# Altium project rp42.PrjPcb
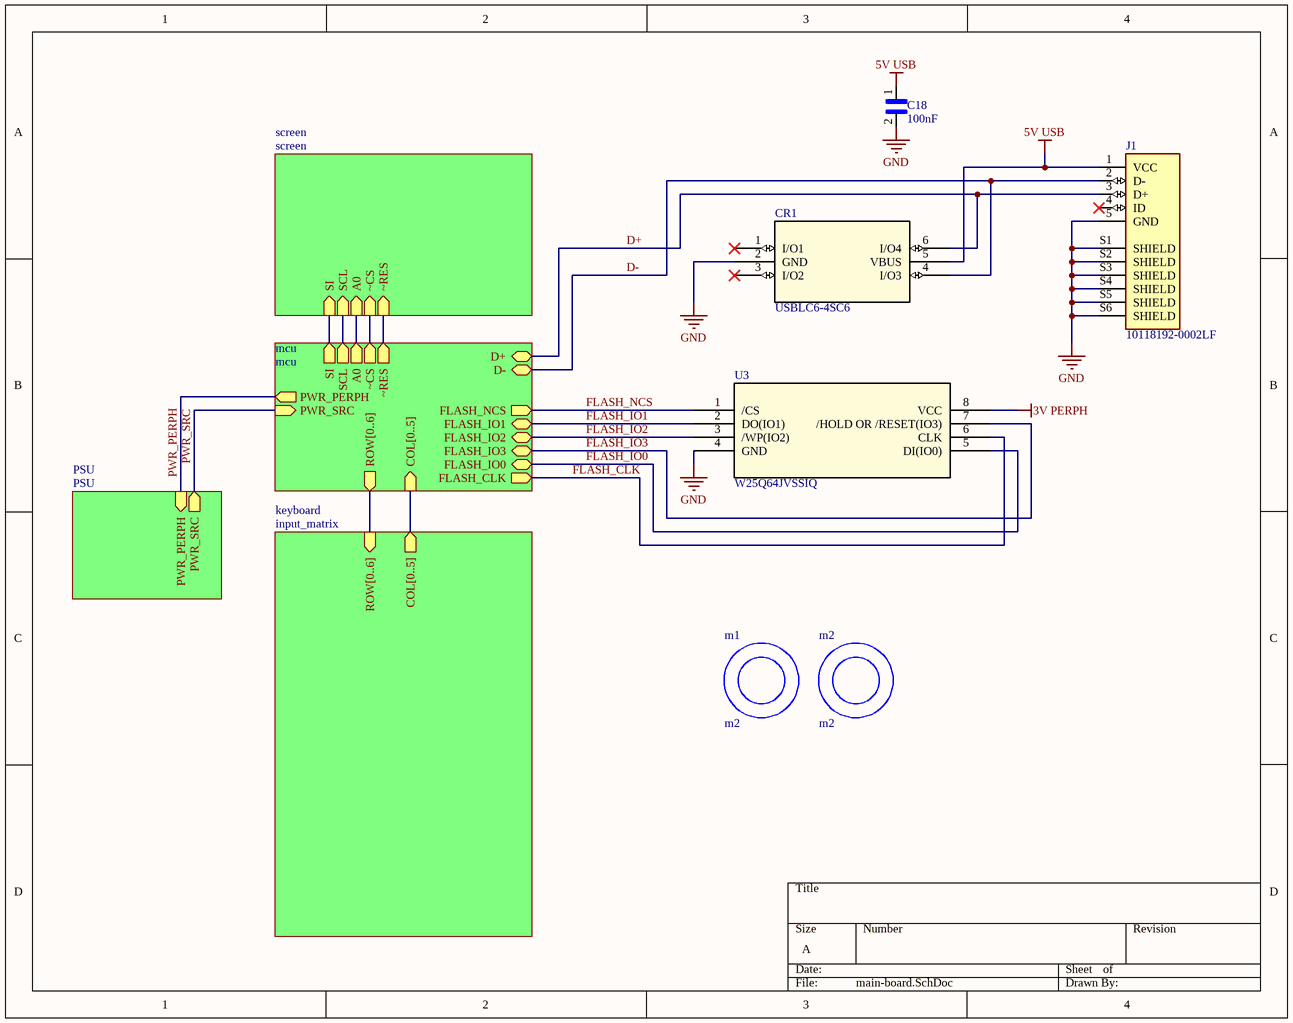
[diagram p0: main-board.SchDoc]
5 sheets, 74 parts. Net scope: hierarchical (ports join the sheet entries above them; power ports are global).
Board file: main-board.PcbDoc
Sheets:
  main-board.SchDoc
    keyboard = input_matrix.SchDoc
    mcu = mcu.SchDoc
    screen = screen.SchDoc
    PSU = PSU.SchDoc

## Sheet main-board.SchDoc
size A; SheetNumber: 1; SheetTotal: 5

### Parts
C18  100nF  [CAPC1005X55N]
CR1  USBLC6-4SC6  [SOT23-6L_STM]
J1  10118192-0002LF  [AMPHENOL_10118192-0002LF]
m1  m2  [m2]
m2  m2  [m2]
U3  W25Q64JVSSIQ  [SOIC-8_5P28X5P28_WIN]

### Sub-sheets
keyboard = input_matrix: ROW[0..6] (in), COL[0..5] (out)
mcu = mcu: ROW[0..6] (out), COL[0..5] (in), SI (out), SCL (out), A0 (out), ~CS (out), ~RES (out), FLASH_IO1 (bidir), FLASH_IO0 (bidir), FLASH_CLK (out), FLASH_NCS (out), FLASH_IO2 (bidir), FLASH_IO3 (bidir), PWR_SRC (in), D- (bidir), D+ (bidir), PWR_PERPH (out)
PSU = PSU: PWR_SRC (out), PWR_PERPH (in)
screen = screen: SI (in), SCL (in), A0 (in), ~CS (in), ~RES (in)

### Nets
3V PERPH: U3.8(VCC)
5V USB: C18.1 CR1.5(VBUS) J1.1(VCC)
GND: C18.2 CR1.2(GND) J1.5(GND) J1.S1(SHIELD) J1.S2(SHIELD) J1.S3(SHIELD) J1.S4(SHIELD) J1.S5(SHIELD) J1.S6(SHIELD) U3.4(GND)
D+: CR1.6(I/O4) J1.3(D+) ; sheet mcu/D+
D-: CR1.4(I/O3) J1.2(D-) ; sheet mcu/D-
FLASH_CLK: U3.6(CLK) ; sheet mcu/FLASH_CLK
FLASH_IO0: U3.5(DI(IO0)) ; sheet mcu/FLASH_IO0
FLASH_IO1: U3.2(DO(IO1)) ; sheet mcu/FLASH_IO1
FLASH_IO2: U3.3(/WP(IO2)) ; sheet mcu/FLASH_IO2
FLASH_IO3: U3.7(/HOLD_OR_/RESET(IO3)) ; sheet mcu/FLASH_IO3
FLASH_NCS: U3.1(/CS) ; sheet mcu/FLASH_NCS
LCD_A0: sheet mcu/A0, sheet screen/A0
LCD_CS: sheet mcu/~CS, sheet screen/~CS
LCD_RES: sheet mcu/~RES, sheet screen/~RES
LCD_SCL: sheet mcu/SCL, sheet screen/SCL
LCD_SI: sheet mcu/SI, sheet screen/SI
PWR_PERPH: sheet mcu/PWR_PERPH, sheet PSU/PWR_PERPH
PWR_SRC: sheet mcu/PWR_SRC, sheet PSU/PWR_SRC

Not connected (* = marked no-connect by the designer): CR1 1(I/O1)* 3(I/O2)*; J1 4(ID)*

### Buses and harness runs
bus sheet keyboard/COL[0..5] = sheet mcu/COL[0..5]
bus sheet keyboard/ROW[0..6] = sheet mcu/ROW[0..6]

### Library data of the parts
C18 = CL05B104KP5NNNC: 0.1ÂµF Â±10% 10V Ceramic Capacitor X7R 0402 _1005 Metric_; MF: Samsung Electro-Mechanics; MP: CL05B104KP5NNNC; Availability: Unavailable; SnapEDA_Link: https://www.snapeda.com/parts/CL05B104KP5NNNC/Samsung%20Electro-Mechanics/view-part/1365387/?ref=snap; Package: 0402 Samsung; Price: None; Value: *
CR1 = USBLC6-4SC6: No Description Available; Mfr_Name: STMicroelectronics; RefDes: RefDes; Type: Type
J1 = 10118192-0002LF: Micro USB 2.0, Input Output Connectors, B TYPE RECEPTACLE without flange; MF: Amphenol ICC; SnapEDA_Link: https://www.snapeda.com/parts/10118192-0002LF/Amphenol+FCI/view-part/?ref=snap; Package: None; Value: *; MP: 10118192-0002LF; Check_prices: https://www.snapeda.com/parts/10118192-0002LF/Amphenol+FCI/view-part/?ref=eda
U3 = W25Q64JVSSIQ: W25Q64JVSSIQ. 64MBit Quad-SPI flash; Mfr_Name: Winbond; RefDes: RefDes; Type: Type

## Sheet input_matrix.SchDoc
size A; SheetNumber: 2; SheetTotal: 5
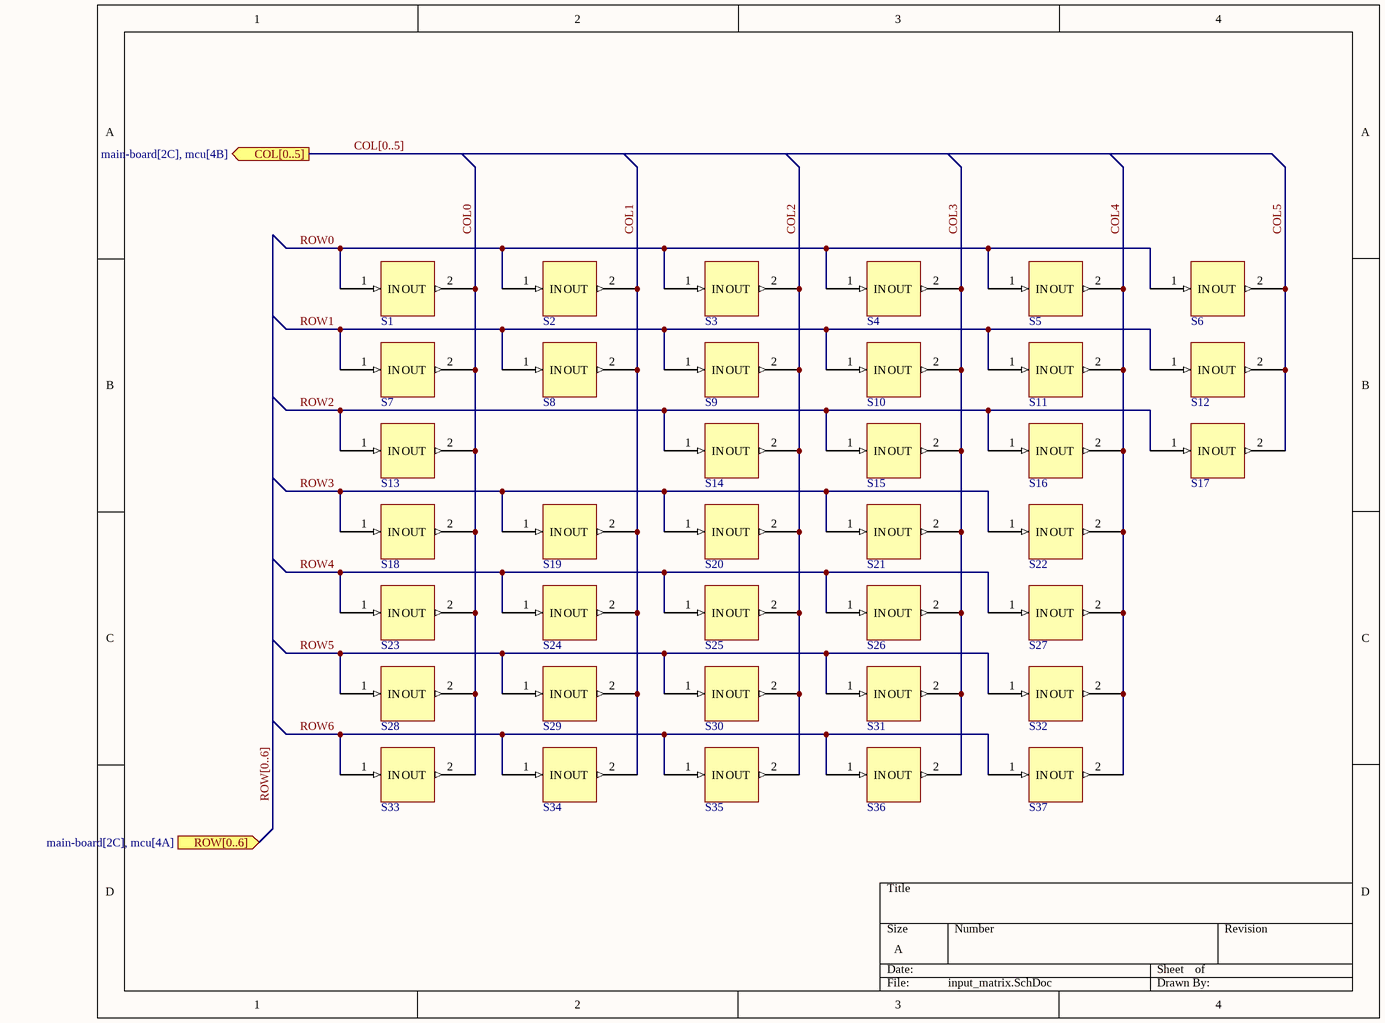
[diagram p1: input_matrix.SchDoc]

### Parts
S1  temp_switch  [PCBComponent_1]  (value not drawn)
S2  temp_switch  [PCBComponent_1]  (value not drawn)
S3  temp_switch  [PCBComponent_1]  (value not drawn)
S4  temp_switch  [PCBComponent_1]  (value not drawn)
S5  temp_switch  [PCBComponent_1]  (value not drawn)
S6  temp_switch  [PCBComponent_1]  (value not drawn)
S7  temp_switch  [PCBComponent_1]  (value not drawn)
S8  temp_switch  [PCBComponent_1]  (value not drawn)
S9  temp_switch  [PCBComponent_1]  (value not drawn)
S10  temp_switch  [PCBComponent_1]  (value not drawn)
S11  temp_switch  [PCBComponent_1]  (value not drawn)
S12  temp_switch  [PCBComponent_1]  (value not drawn)
S13  temp_switch  [PCBComponent_1]  (value not drawn)
S14  temp_switch  [PCBComponent_1]  (value not drawn)
S15  temp_switch  [PCBComponent_1]  (value not drawn)
S16  temp_switch  [PCBComponent_1]  (value not drawn)
S17  temp_switch  [PCBComponent_1]  (value not drawn)
S18  temp_switch  [PCBComponent_1]  (value not drawn)
S19  temp_switch  [PCBComponent_1]  (value not drawn)
S20  temp_switch  [PCBComponent_1]  (value not drawn)
S21  temp_switch  [PCBComponent_1]  (value not drawn)
S22  temp_switch  [PCBComponent_1]  (value not drawn)
S23  temp_switch  [PCBComponent_1]  (value not drawn)
S24  temp_switch  [PCBComponent_1]  (value not drawn)
S25  temp_switch  [PCBComponent_1]  (value not drawn)
S26  temp_switch  [PCBComponent_1]  (value not drawn)
S27  temp_switch  [PCBComponent_1]  (value not drawn)
S28  temp_switch  [PCBComponent_1]  (value not drawn)
S29  temp_switch  [PCBComponent_1]  (value not drawn)
S30  temp_switch  [PCBComponent_1]  (value not drawn)
S31  temp_switch  [PCBComponent_1]  (value not drawn)
S32  temp_switch  [PCBComponent_1]  (value not drawn)
S33  temp_switch  [PCBComponent_1]  (value not drawn)
S34  temp_switch  [PCBComponent_1]  (value not drawn)
S35  temp_switch  [PCBComponent_1]  (value not drawn)
S36  temp_switch  [PCBComponent_1]  (value not drawn)
S37  temp_switch  [PCBComponent_1]  (value not drawn)

### Ports
COL[0..5] (out, see main-board[2C], mcu[4B]), ROW[0..6] (in, see main-board[2C], mcu[4A])

### Nets
COL0: S1.2(OUT) S7.2(OUT) S13.2(OUT) S18.2(OUT) S23.2(OUT) S28.2(OUT) S33.2(OUT)
COL1: S2.2(OUT) S8.2(OUT) S19.2(OUT) S24.2(OUT) S29.2(OUT) S34.2(OUT)
COL2: S3.2(OUT) S9.2(OUT) S14.2(OUT) S20.2(OUT) S25.2(OUT) S30.2(OUT) S35.2(OUT)
COL3: S4.2(OUT) S10.2(OUT) S15.2(OUT) S21.2(OUT) S26.2(OUT) S31.2(OUT) S36.2(OUT)
COL4: S5.2(OUT) S11.2(OUT) S16.2(OUT) S22.2(OUT) S27.2(OUT) S32.2(OUT) S37.2(OUT)
COL5: S6.2(OUT) S12.2(OUT) S17.2(OUT)
ROW0: S1.1(IN) S2.1(IN) S3.1(IN) S4.1(IN) S5.1(IN) S6.1(IN)
ROW1: S7.1(IN) S8.1(IN) S9.1(IN) S10.1(IN) S11.1(IN) S12.1(IN)
ROW2: S13.1(IN) S14.1(IN) S15.1(IN) S16.1(IN) S17.1(IN)
ROW3: S18.1(IN) S19.1(IN) S20.1(IN) S21.1(IN) S22.1(IN)
ROW4: S23.1(IN) S24.1(IN) S25.1(IN) S26.1(IN) S27.1(IN)
ROW5: S28.1(IN) S29.1(IN) S30.1(IN) S31.1(IN) S32.1(IN)
ROW6: S33.1(IN) S34.1(IN) S35.1(IN) S36.1(IN) S37.1(IN)

### Buses and harness runs
bus COL[0..5] = port COL[0..5]
bus ROW[0..6] = port ROW[0..6]

## Sheet mcu.SchDoc
size A; SheetNumber: 4; SheetTotal: 5
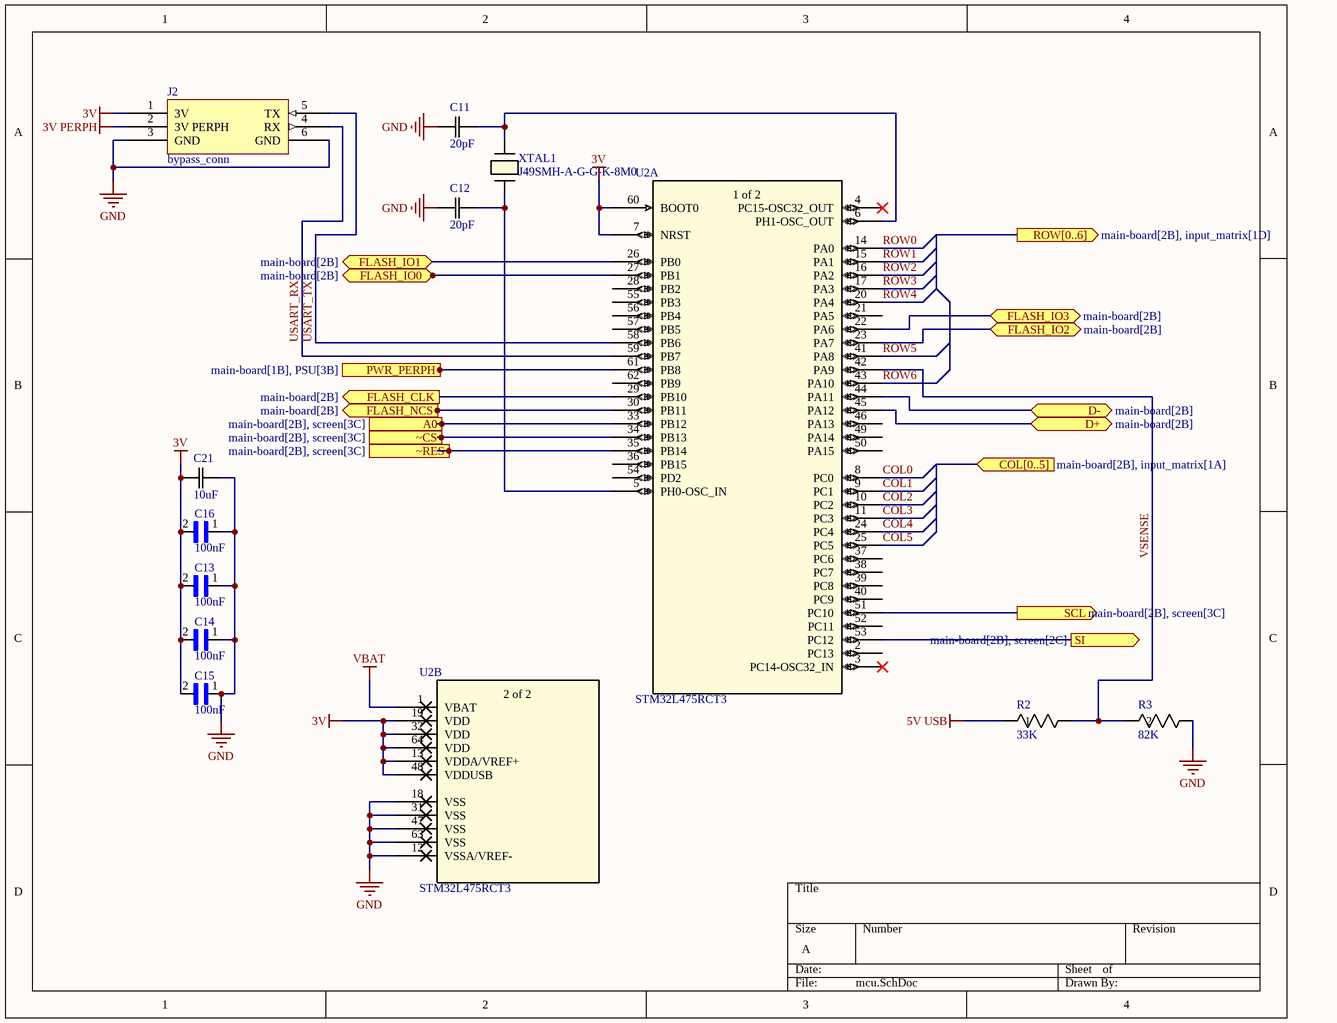
[diagram p2: mcu.SchDoc]

### Parts
C11  20pF  [CAP_CL10_SAM]
C12  20pF  [CAP_CL10_SAM]
C13  100nF  [CAPC1005X55N]
C14  100nF  [CAPC1005X55N]
C15  100nF  [CAPC1005X55N]
C16  100nF  [CAPC1005X55N]
C21  10uF  [CAP_CL10_SAM]
J2  bypass_conn  [bypass_conn]
R2  33K  [STA_RMCF0603_STP]
R3  82K  [RC0603N_YAG]
U2  STM32L475RCT3  [LQFP64-10x10mm]  (parts A,B of 2)
XTAL1  J49SMH-A-G-G-K-8M0  [XTAL_J49SMH-A-G-G-K-8M0_JAU]

### Ports
A0 (out, see main-board[2B], screen[3C]), COL[0..5] (in, see main-board[2B], input_matrix[1A]), D+ (bidir, see main-board[2B]), D- (bidir, see main-board[2B]), FLASH_CLK (out, see main-board[2B]), FLASH_IO0 (bidir, see main-board[2B]), FLASH_IO1 (bidir, see main-board[2B]), FLASH_IO2 (bidir, see main-board[2B]), FLASH_IO3 (bidir, see main-board[2B]), FLASH_NCS (out, see main-board[2B]), PWR_PERPH (out, see main-board[1B], PSU[3B]), ROW[0..6] (out, see main-board[2B], input_matrix[1D]), SCL (out, see main-board[2B], screen[3C]), SI (out, see main-board[2B], screen[2C]), ~CS (out, see main-board[2B], screen[3C]), ~RES (out, see main-board[2B], screen[3C])

### Nets
3V: C13.2 C14.2 C15.2 C16.2 C21.1 J2.1(3V) U2.7(NRST) U2.13(VDDA/VREF+) U2.19(VDD) U2.32(VDD) U2.48(VDDUSB) U2.60(BOOT0) U2.64(VDD)
3V PERPH: J2.2(3V_PERPH)
5V USB: R2.1
GND: C11.1 C12.1 C13.1 C14.1 C15.1 C16.1 C21.2 J2.3(GND) J2.6(GND) R3.1 U2.12(VSSA/VREF-) U2.18(VSS) U2.31(VSS) U2.47(VSS) U2.63(VSS)
VBAT: U2.1(VBAT)
COL0: U2.8(PC0)
COL1: U2.9(PC1)
COL2: U2.10(PC2)
COL3: U2.11(PC3)
COL4: U2.24(PC4)
COL5: U2.25(PC5)
D+: U2.45(PA12) ; port D+
D-: U2.44(PA11) ; port D-
FLASH_CLK: U2.29(PB10) ; port FLASH_CLK
FLASH_IO0: U2.27(PB1) ; port FLASH_IO0
FLASH_IO1: U2.26(PB0) ; port FLASH_IO1
FLASH_IO2: U2.23(PA7) ; port FLASH_IO2
FLASH_IO3: U2.22(PA6) ; port FLASH_IO3
FLASH_NCS: U2.30(PB11) ; port FLASH_NCS
LCD_A0: U2.33(PB12) ; port A0
LCD_CS: U2.34(PB13) ; port ~CS
LCD_RES: U2.35(PB14) ; port ~RES
LCD_SCL: U2.51(PC10) ; port SCL
LCD_SI: U2.53(PC12) ; port SI
PWR_PERPH: U2.61(PB8) ; port PWR_PERPH
ROW0: U2.14(PA0)
ROW1: U2.15(PA1)
ROW2: U2.16(PA2)
ROW3: U2.17(PA3)
ROW4: U2.20(PA4)
ROW5: U2.41(PA8)
ROW6: U2.43(PA10)
USART_RX: J2.4(RX) U2.59(PB7)
USART_TX: J2.5(TX) U2.58(PB6)
VSENSE: R2.2 R3.2 U2.42(PA9)
NetC11_2: C11.2 U2.6(PH1-OSC_OUT) XTAL1.2
NetC12_2: C12.2 U2.5(PH0-OSC_IN) XTAL1.1

Not connected (* = marked no-connect by the designer): U2 2(PC13) 3(PC14-OSC32_IN)* 4(PC15-OSC32_OUT)* 21(PA5) 28(PB2) 36(PB15) 37(PC6) 38(PC7) 39(PC8) 40(PC9) 46(PA13) 49(PA14) 50(PA15) 52(PC11) 54(PD2) 55(PB3) 56(PB4) 57(PB5) 62(PB9)

### Notes on the sheet
- (in symbol STM32L475RCT3, part A) 1 of 2
- (in symbol STM32L475RCT3, part B) 2 of 2

### Library data of the parts
C11 C12 = CL10C200JB8NNNC: Mfr_Name: Samsung
C13-C16 = CL05B104KP5NNNC: as C18 on sheet main-board; MP: CL05B104KP5NNNC; Availability: Unavailable; SnapEDA_Link: https://www.snapeda.com/parts/CL05B104KP5NNNC/Samsung%20Electro-Mechanics/view-part/1365387/?ref=snap; Package: 0402 Samsung; Price: None; Value: *
C21 = CL10A106KQ8NNNL: Mfr_Name: Samsung
J2 = bypass_conn: Bypass connector for power supply and backup chip programming
R2 = RMCF0603FT33K0: Mfr_Name: Stackpole International
R3 = RC0603FR-0782KL: Mfr_Name: Yageo
U2 = STM32L475RCT3: STM32 - 256KB, 128KB RAM, USB OTG, QUAD SPI / https://www.st.com/en/microcontrollers-microprocessors/stm32l475rc.html#overview; Mfr_Name: STMicroelectronics; RefDes: RefDes; Type: Type
XTAL1 = J49SMH-A-G-G-K-8M0: No Description Available; Mfr_Name: Jauch

## Sheet screen.SchDoc
size A; SheetNumber: 3; SheetTotal: 5
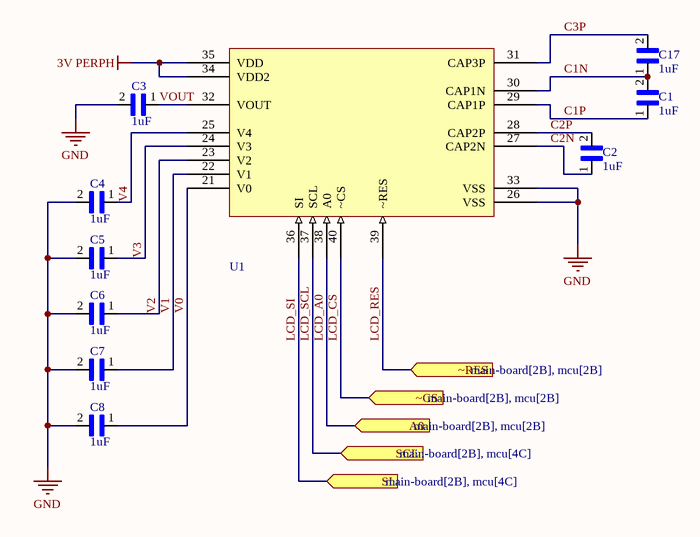
[diagram p3: screen.SchDoc]

### Parts
C1  1uF  [CAPC1608X90N]
C2  1uF  [CAPC1608X90N]
C3  1uF  [CAPC1608X90N]
C4  1uF  [CAPC1608X90N]
C5  1uF  [CAPC1608X90N]
C6  1uF  [CAPC1608X90N]
C7  1uF  [CAPC1608X90N]
C8  1uF  [CAPC1608X90N]
C17  1uF  [CAPC1608X90N]
U1  INTERFACE  [INTERFACE]  (value not drawn)

### Ports
A0 (in, see main-board[2B], mcu[2B]), SCL (in, see main-board[2B], mcu[4C]), SI (in, see main-board[2B], mcu[4C]), ~CS (in, see main-board[2B], mcu[2B]), ~RES (in, see main-board[2B], mcu[2B])

### Nets
3V PERPH: U1.34(VDD2) U1.35(VDD)
GND: C3.2 C4.2 C5.2 C6.2 C7.2 C8.2 U1.26(VSS) U1.33(VSS)
C1N: C1.2 C17.1 U1.30(CAP1N)
C1P: C1.1 U1.29(CAP1P)
C2N: C2.1 U1.27(CAP2N)
C2P: C2.2 U1.28(CAP2P)
C3P: C17.2 U1.31(CAP3P)
LCD_A0: U1.38(A0) ; port A0
LCD_CS: U1.40(~CS) ; port ~CS
LCD_RES: U1.39(~RES) ; port ~RES
LCD_SCL: U1.37(SCL) ; port SCL
LCD_SI: U1.36(SI) ; port SI
V0: C8.1 U1.21(V0)
V1: C7.1 U1.22(V1)
V2: C6.1 U1.23(V2)
V3: C5.1 U1.24(V3)
V4: C4.1 U1.25(V4)
VOUT: C3.1 U1.32(VOUT)

### Library data of the parts
C1-C8 C17 = CL10B105KP8NNNC: Package: None; Price: None; Value: *; MP: CL10B105KP8NNNC; Availability: Unavailable

## Sheet PSU.SchDoc
size A; SheetNumber: 5; SheetTotal: 5
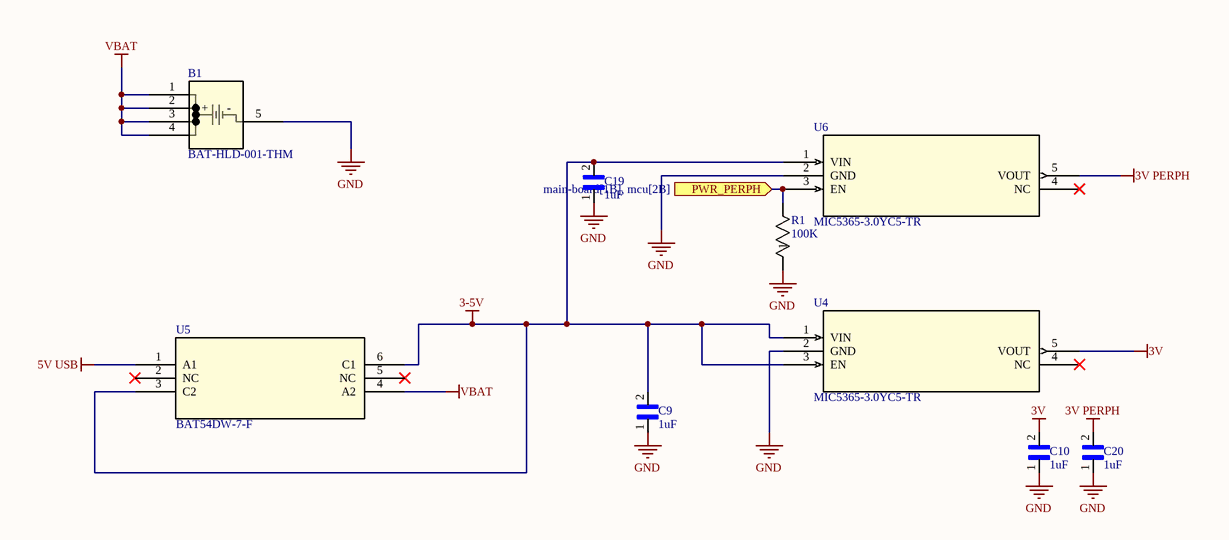
[diagram p4: PSU.SchDoc]

### Parts
B1  BAT-HLD-001-THM  [BAT-HLD-001-THM_TEC]
C9  1uF  [CAPC1608X90N]
C10  1uF  [CAPC1608X90N]
C19  1uF  [CAPC1608X90N]
C20  1uF  [CAPC1608X90N]
R1  100K  [RC0603N_YAG]
U4  MIC5365-3.0YC5-TR  [SC-70_C5_MCH]
U5  BAT54DW-7-F  [SOT-363_DIO]
U6  MIC5365-3.0YC5-TR  [SC-70_C5_MCH]

### Ports
PWR_PERPH (in, see main-board[1B], mcu[2B])

### Nets
3-5V: C9.2 C19.2 U4.1(VIN) U4.3(EN) U5.3(C2) U5.6(C1) U6.1(VIN)
3V: C10.2 U4.5(VOUT)
3V PERPH: C20.2 U6.5(VOUT)
5V USB: U5.1(A1)
GND: B1.5(NEGATIVE) C9.1 C10.1 C19.1 C20.1 R1.1 U4.2(GND) U6.2(GND)
VBAT: B1.1(POSITIVE) B1.2(POSITIVE) B1.3(POSITIVE) B1.4(POSITIVE) U5.4(A2)
PWR_PERPH: R1.2 U6.3(EN) ; port PWR_PERPH

Not connected (* = marked no-connect by the designer): U4 4(NC)*; U5 2(NC)* 5(NC)*; U6 4(NC)*

### Notes on the sheet
- (in symbol BAT-HLD-001-THM) +; -

### Library data of the parts
B1 = BAT-HLD-001-THM: CR2032 Battery holder. 2.7V-3V. / https://www.digikey.com/en/products/detail/te-connectivity-linx/BAT-HLD-001-THM/3044009; Mfr_Name: TE Connectivity; RefDes: RefDes; Type: Type; Supplier 1: Digikey; Supplier Part Number 1: BAT-HLD-001-THM-ND
C9 C19 = CL10B105KP8NNNC: CL10B105KP8NNNC. / https://www.digikey.com/en/products/detail/samsung-electro-mechanics/CL10B105KP8NNNC/3887604?s=N4IgTCBcDaIMIBkCMAGAQqgrAaQAoA4A5YuEAXQF8g; Package: None; Price: None; Value: *; MP: CL10B105KP8NNNC; Availability: Unavailable; Supplier 1: Avnet; Supplier Part Number 1: CL10B105KP8NNNC
C10 = CL10B105KP8NNNC: CL10B105KP8NNNC / https://www.digikey.com/en/products/detail/samsung-electro-mechanics/CL10B105KP8NNNC/3887604?s=N4IgTCBcDaIMIBkCMAGAQqgrAaQAoA4A5YuEAXQF8g; Package: None; Price: None; Value: *; MP: CL10B105KP8NNNC; Availability: Unavailable; Supplier 1: Avnet; Supplier Part Number 1: CL10B105KP8NNNC
C20 = CL10B105KP8NNNC: Package: None; Price: None; Value: *; MP: CL10B105KP8NNNC; Availability: Unavailable; Supplier 1: Avnet; Supplier Part Number 1: CL10B105KP8NNNC
R1 = RC0603FR-07100KL: Mfr_Name: Yageo
U4 U6 = MIC5365-3.0YC5-TR: 3V Linear Voltage Regulator. / https://www.digikey.com/en/products/detail/microchip-technology/MIC5365-3-0YC5-TR/1868092?s=N4IgTCBcDaILIEkDCBWAzANhQWjQOgAYBNVbAFQCUQBdAXyA; Mfr_Name: Microchip; RefDes: RefDes; Type: Type; Supplier 1: Newark; Supplier Part Number 1: 55AC2794
U5 = BAT54DW-7-F: 2 Diode Array, 30V@100mA, Surface mount. Schottky. 6-TSSOP. / https://www.diodes.com/assets/Datasheets/BAT54DW.pdf; Mfr_Name: Diodes Inc; RefDes: RefDes; Type: Type; Supplier 1: Arrow Electronics; Supplier Part Number 1: BAT54DW-7-F

## Nets that join several sheets
3V: mcu (13 pins), PSU (C10.2 U4.5)
3V PERPH: main-board (U3.8), mcu (J2.2), screen (U1.34 U1.35), PSU (C20.2 U6.5)
5V USB: main-board (C18.1 CR1.5 J1.1), mcu (R2.1), PSU (U5.1)
GND: main-board (10 pins), mcu (15 pins), screen (8 pins), PSU (8 pins)
VBAT: mcu (U2.1), PSU (5 pins)
D+: main-board (CR1.6 J1.3), mcu (U2.45)
D-: main-board (CR1.4 J1.2), mcu (U2.44)
FLASH_CLK: main-board (U3.6), mcu (U2.29)
FLASH_IO0: main-board (U3.5), mcu (U2.27)
FLASH_IO1: main-board (U3.2), mcu (U2.26)
FLASH_IO2: main-board (U3.3), mcu (U2.23)
FLASH_IO3: main-board (U3.7), mcu (U2.22)
FLASH_NCS: main-board (U3.1), mcu (U2.30)
LCD_A0: mcu (U2.33), screen (U1.38)
LCD_CS: mcu (U2.34), screen (U1.40)
LCD_RES: mcu (U2.35), screen (U1.39)
LCD_SCL: mcu (U2.51), screen (U1.37)
LCD_SI: mcu (U2.53), screen (U1.36)
PWR_PERPH: mcu (U2.61), PSU (R1.2 U6.3)